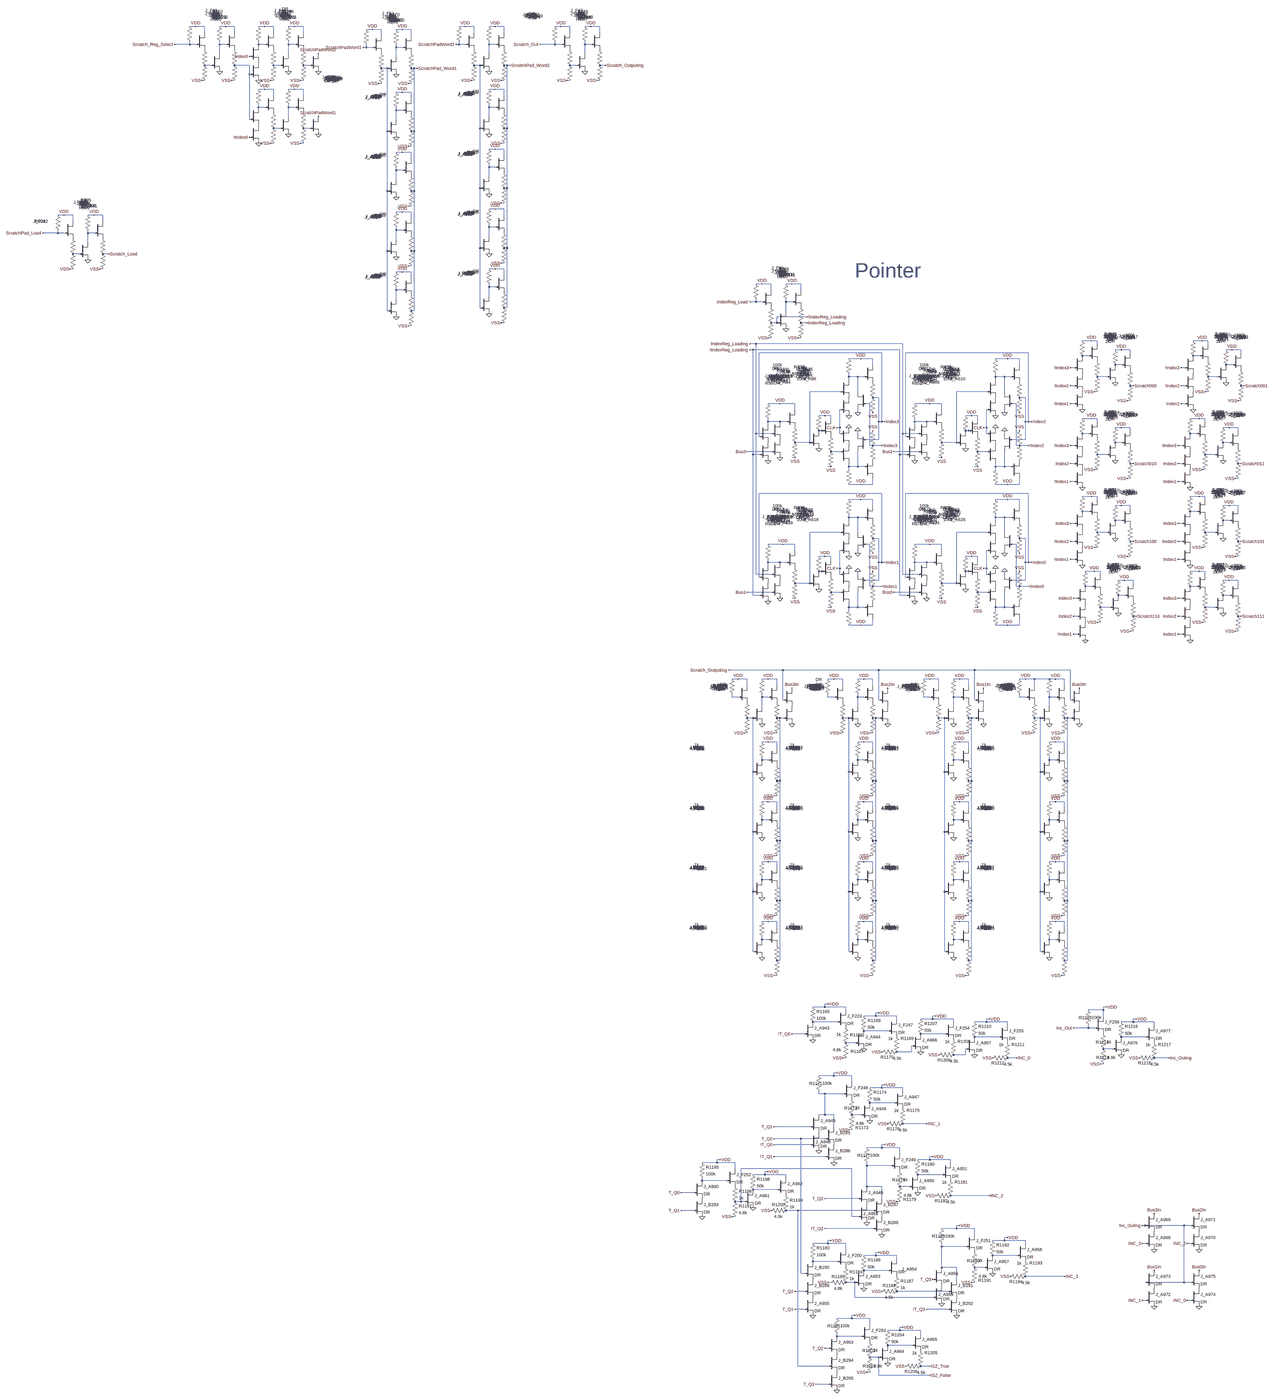
[diagram p0: schematic Controls.asc, whole sheet]
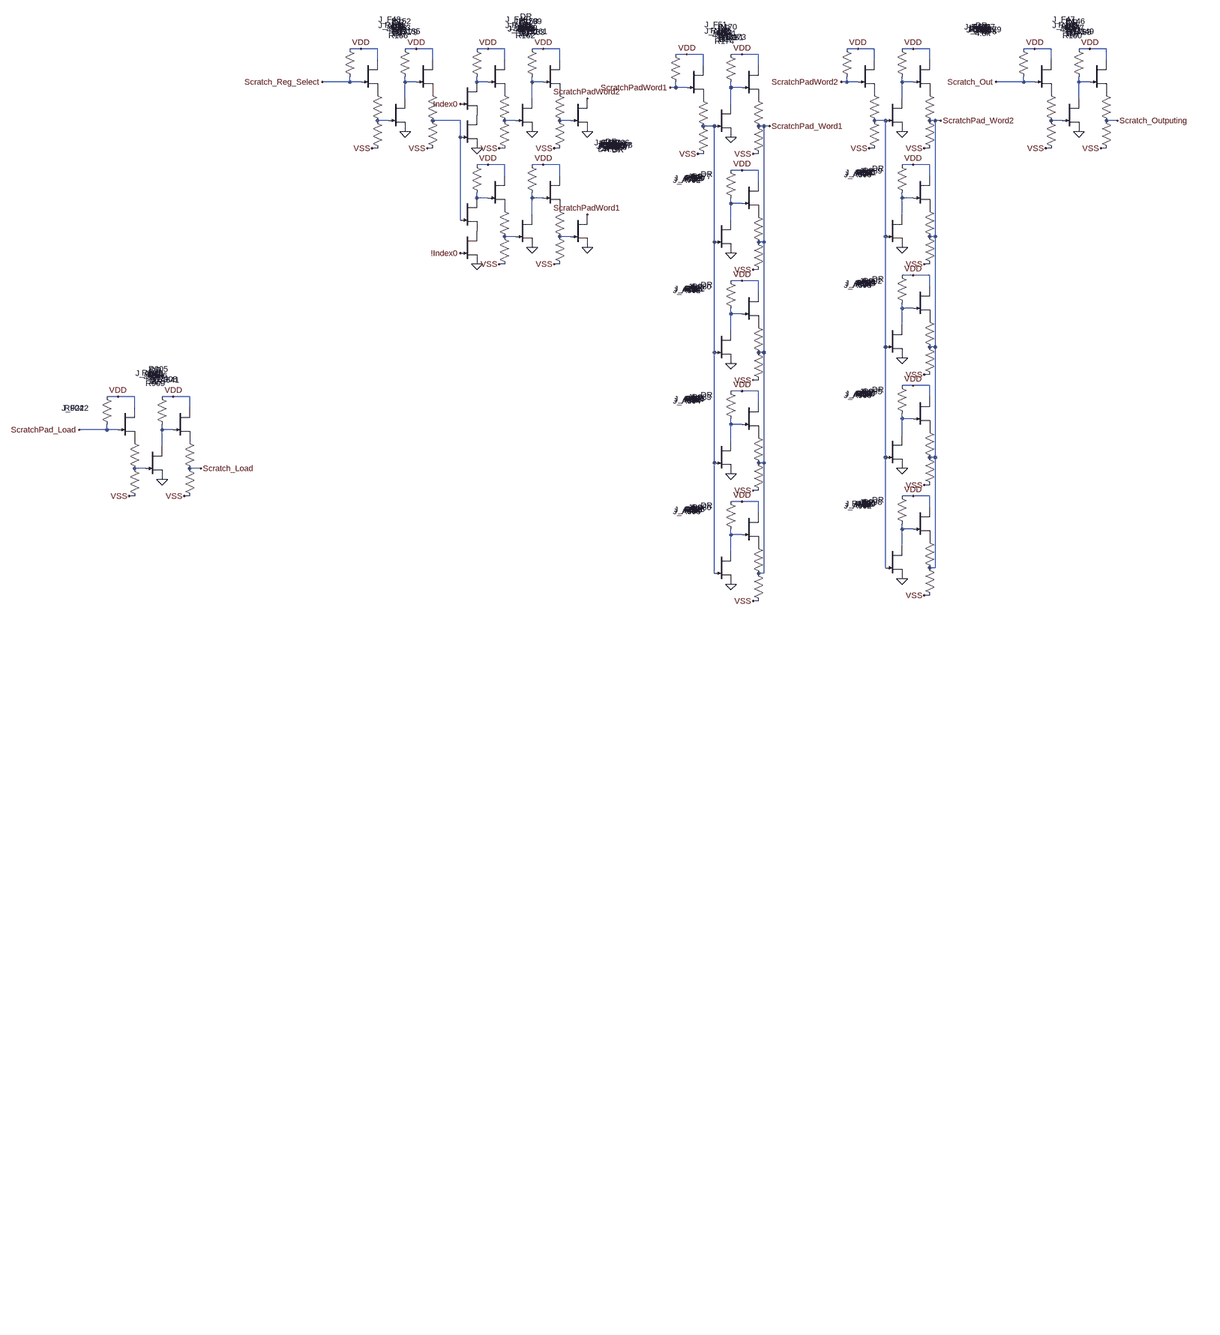
[diagram p1: schematic Controls.asc, part, row 1 of 2, column 1 of 2]
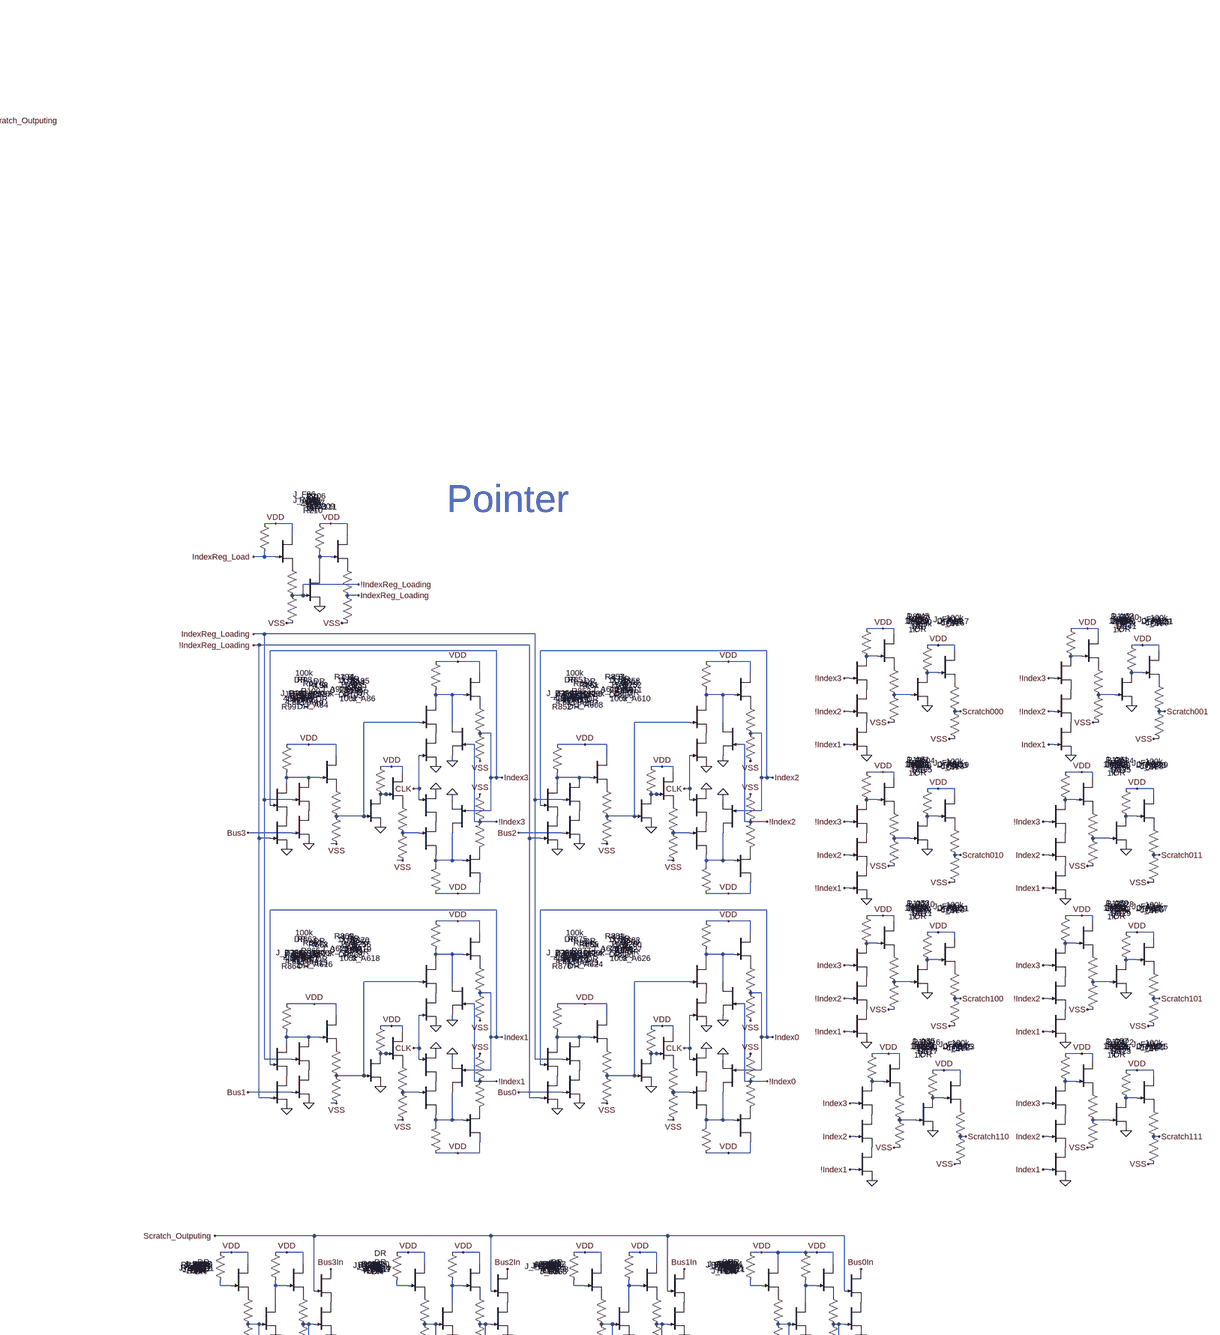
[diagram p2: schematic Controls.asc, part, row 1 of 2, column 2 of 2]
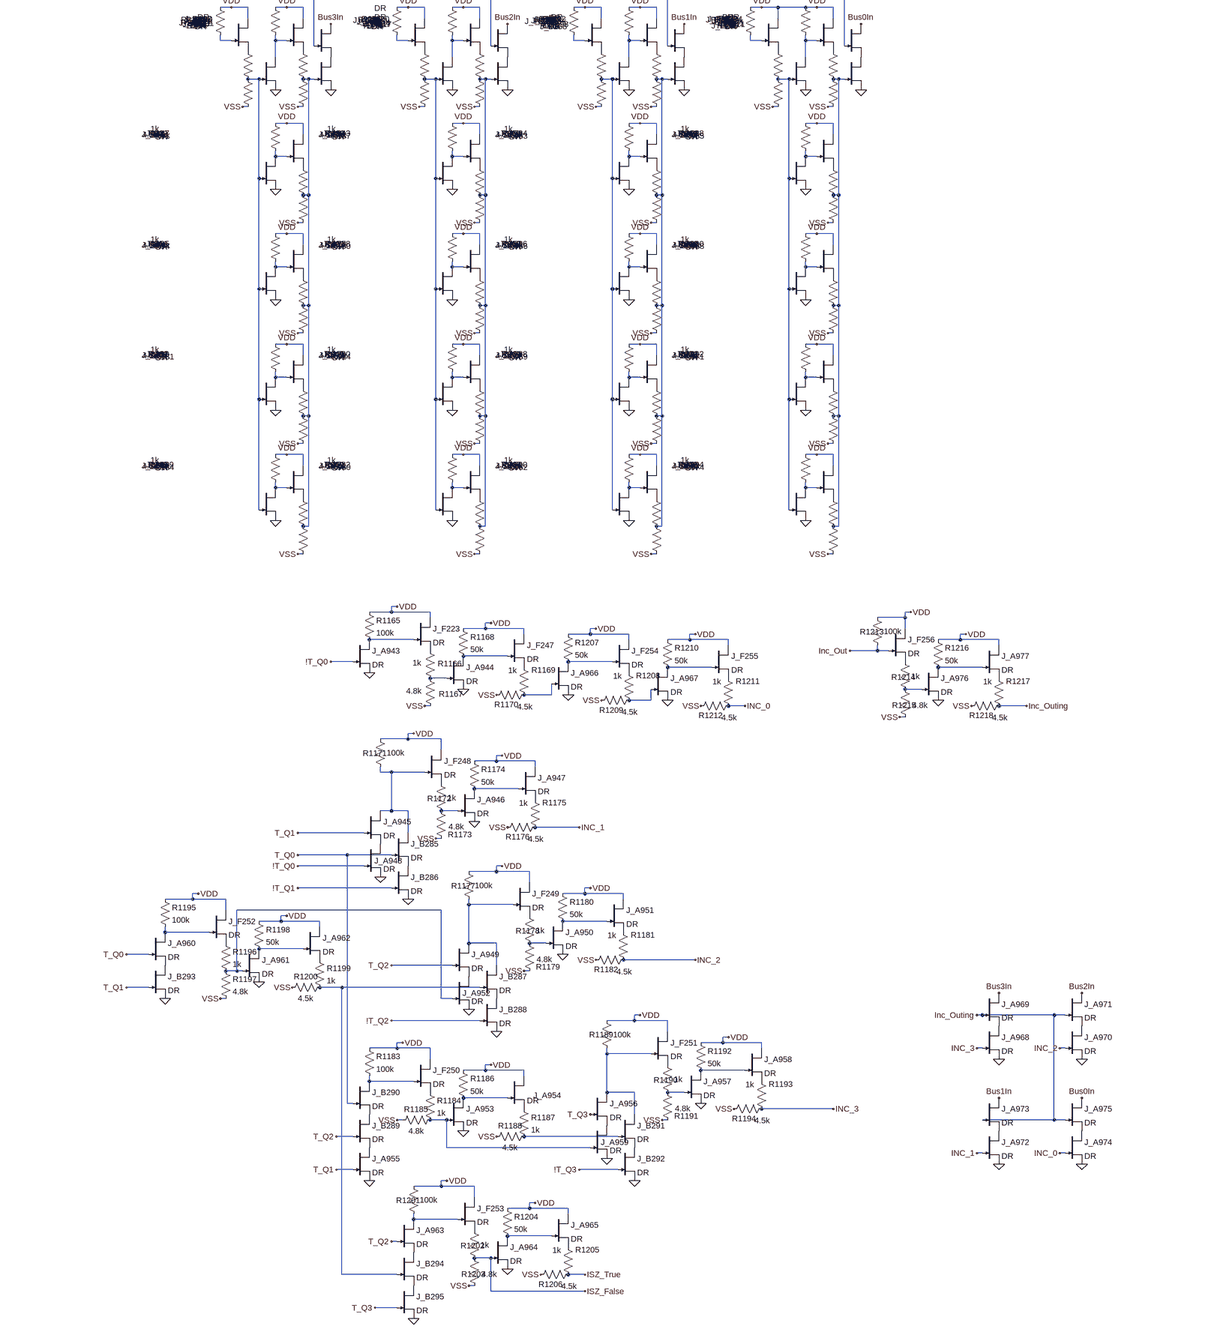
[diagram p3: schematic Controls.asc, part, row 2 of 2, column 2 of 2]
* Controls.asc
J_A48 N033 N037 P001 DR
R97 VDD N033 100k
J_F78 VDD N033 P002 DR
R98 P002 Index3 1k
R99 Index3 VSS 4.8k
J_B32 N033 !Index3 0 DR
J_A49 N051 N047 P003 DR
R100 VDD N051 100k
J_F79 VDD N051 P004 DR
R101 P004 !Index3 1k
R102 !Index3 VSS 4.8k
J_B33 N051 Index3 0 DR
J_A84 P001 CLK 0 DR
J_A85 P003 CLK 0 DR
J_A86 N039 Index3 P005 DR
R193 VDD N039 100k
J_F80 VDD N039 P006 DR
R194 P006 N037 1k
R195 N037 VSS 4.8k
J_B34 N039 IndexReg_Loading P007 DR
J_A87 N041 N037 0 DR
R196 VDD N041 50k
J_A92 VDD N041 P008 DR
R197 P008 N047 1k
R198 N047 VSS 4.5k
J_A93 P005 !IndexReg_Loading 0 DR
J_B35 P007 Bus3 0 DR
J_A606 N034 N038 P009 DR
R850 VDD N034 100k
J_F209 VDD N034 P010 DR
R851 P010 Index2 1k
R852 Index2 VSS 4.8k
J_B249 N034 !Index2 0 DR
J_A607 N052 N048 P011 DR
R853 VDD N052 100k
J_F210 VDD N052 P012 DR
R854 P012 !Index2 1k
R855 !Index2 VSS 4.8k
J_B250 N052 Index2 0 DR
J_A608 P009 CLK 0 DR
J_A609 P011 CLK 0 DR
J_A610 N040 Index2 P013 DR
R856 VDD N040 100k
J_F211 VDD N040 P014 DR
R857 P014 N038 1k
R858 N038 VSS 4.8k
J_B251 N040 IndexReg_Loading P015 DR
J_A611 N042 N038 0 DR
R859 VDD N042 50k
J_A612 VDD N042 P016 DR
R860 P016 N048 1k
R861 N048 VSS 4.5k
J_A613 P013 !IndexReg_Loading 0 DR
J_B252 P015 Bus2 0 DR
J_A614 N055 N059 P017 DR
R862 VDD N055 100k
J_F212 VDD N055 P018 DR
R863 P018 Index1 1k
R864 Index1 VSS 4.8k
J_B253 N055 !Index1 0 DR
J_A615 N073 N069 P019 DR
R865 VDD N073 100k
J_F213 VDD N073 P020 DR
R866 P020 !Index1 1k
R867 !Index1 VSS 4.8k
J_B254 N073 Index1 0 DR
J_A616 P017 CLK 0 DR
J_A617 P019 CLK 0 DR
J_A618 N063 Index1 P021 DR
R868 VDD N063 100k
J_F214 VDD N063 P022 DR
R869 P022 N059 1k
R870 N059 VSS 4.8k
J_B255 N063 IndexReg_Loading P023 DR
J_A619 N065 N059 0 DR
R871 VDD N065 50k
J_A620 VDD N065 P024 DR
R872 P024 N069 1k
R873 N069 VSS 4.5k
J_A621 P021 !IndexReg_Loading 0 DR
J_B256 P023 Bus1 0 DR
J_A622 N056 N060 P025 DR
R874 VDD N056 100k
J_F215 VDD N056 P026 DR
R875 P026 Index0 1k
R876 Index0 VSS 4.8k
J_B257 N056 !Index0 0 DR
J_A623 N074 N070 P027 DR
R877 VDD N074 100k
J_F216 VDD N074 P028 DR
R878 P028 !Index0 1k
R879 !Index0 VSS 4.8k
J_B258 N074 Index0 0 DR
J_A624 P025 CLK 0 DR
J_A625 P027 CLK 0 DR
J_A626 N064 Index0 P029 DR
R880 VDD N064 100k
J_F217 VDD N064 P030 DR
R881 P030 N060 1k
R882 N060 VSS 4.8k
J_B259 N064 IndexReg_Loading P031 DR
J_A627 N066 N060 0 DR
R883 VDD N066 50k
J_A628 VDD N066 P032 DR
R884 P032 N070 1k
R885 N070 VSS 4.5k
J_A629 P029 !IndexReg_Loading 0 DR
J_B260 P031 Bus0 0 DR
R904 VDD ScratchPad_Load 100k
J_F222 VDD ScratchPad_Load P033 DR
R905 P033 N025 1k
R906 N025 VSS 4.8k
J_A640 N024 N025 0 DR
R907 VDD N024 50k
J_A641 VDD N024 P034 DR
R908 P034 Scratch_Load 1k
R909 VSS Scratch_Load 4.5k
J_A44 N029 !Index3 P035 DR
R85 VDD N029 100k
J_F29 VDD N029 P036 DR
R86 P036 N035 1k
R87 N035 VSS 4.8k
J_B16 P035 !Index2 P037 DR
J_A45 N031 N035 0 DR
R88 VDD N031 50k
J_F30 VDD N031 P038 DR
R89 P038 Scratch000 1k
R90 VSS Scratch000 4.5k
J_B17 P037 !Index1 0 DR
J_A50 N043 !Index3 P039 DR
R103 VDD N043 100k
J_F33 VDD N043 P040 DR
R104 P040 N049 1k
R105 N049 VSS 4.8k
J_B18 P039 Index2 P041 DR
J_A51 N045 N049 0 DR
R106 VDD N045 50k
J_F34 VDD N045 P042 DR
R107 P042 Scratch010 1k
R108 VSS Scratch010 4.5k
J_B19 P041 !Index1 0 DR
J_A52 N053 Index3 P043 DR
R109 VDD N053 100k
J_F35 VDD N053 P044 DR
R110 P044 N061 1k
R111 N061 VSS 4.8k
J_B20 P043 !Index2 P045 DR
J_A53 N057 N061 0 DR
R112 VDD N057 50k
J_F36 VDD N057 P046 DR
R113 P046 Scratch100 1k
R114 VSS Scratch100 4.5k
J_B21 P045 !Index1 0 DR
J_A54 N067 Index3 P047 DR
R115 VDD N067 100k
J_F37 VDD N067 P048 DR
R116 P048 N075 1k
R117 N075 VSS 4.8k
J_B22 P047 Index2 P049 DR
J_A55 N071 N075 0 DR
R118 VDD N071 50k
J_F38 VDD N071 P050 DR
R119 P050 Scratch110 1k
R120 VSS Scratch110 4.5k
J_B23 P049 !Index1 0 DR
J_A56 N068 Index3 P051 DR
R121 VDD N068 100k
J_F39 VDD N068 P052 DR
R122 P052 N076 1k
R123 N076 VSS 4.8k
J_B24 P051 Index2 P053 DR
J_A57 N072 N076 0 DR
R124 VDD N072 50k
J_F40 VDD N072 P054 DR
R125 P054 Scratch111 1k
R126 VSS Scratch111 4.5k
J_B25 P053 Index1 0 DR
J_A58 N054 Index3 P055 DR
R127 VDD N054 100k
J_F41 VDD N054 P056 DR
R128 P056 N062 1k
R129 N062 VSS 4.8k
J_B26 P055 !Index2 P057 DR
J_A59 N058 N062 0 DR
R130 VDD N058 50k
J_F42 VDD N058 P058 DR
R131 P058 Scratch101 1k
R132 VSS Scratch101 4.5k
J_B27 P057 Index1 0 DR
J_A60 N044 !Index3 P059 DR
R133 VDD N044 100k
J_F43 VDD N044 P060 DR
R134 P060 N050 1k
R135 N050 VSS 4.8k
J_B28 P059 Index2 P061 DR
J_A61 N046 N050 0 DR
R136 VDD N046 50k
J_F44 VDD N046 P062 DR
R137 P062 Scratch011 1k
R138 VSS Scratch011 4.5k
J_B29 P061 Index1 0 DR
J_A62 N030 !Index3 P063 DR
R139 VDD N030 100k
J_F45 VDD N030 P064 DR
R140 P064 N036 1k
R141 N036 VSS 4.8k
J_B30 P063 !Index2 P065 DR
J_A63 N032 N036 0 DR
R142 VDD N032 50k
J_F46 VDD N032 P066 DR
R143 P066 Scratch001 1k
R144 VSS Scratch001 4.5k
J_B31 P065 Index1 0 DR
R145 VDD Scratch_Out 100k
J_F47 VDD Scratch_Out P067 DR
R146 P067 N012 1k
R147 N012 VSS 4.8k
J_A67 N005 N012 0 DR
R148 VDD N005 50k
J_A68 VDD N005 P068 DR
R149 P068 Scratch_Outputing 1k
R150 VSS Scratch_Outputing 4.5k
R151 VDD Scratch_Reg_Select 100k
J_F48 VDD Scratch_Reg_Select P069 DR
R152 P069 N007 1k
R153 N007 VSS 4.8k
J_A69 N001 N007 0 DR
R154 VDD N001 50k
J_A79 VDD N001 P070 DR
R155 P070 N008 1k
R156 VSS N008 4.5k
R157 VDD N002 100k
J_F49 VDD N002 P071 DR
R158 P071 N009 1k
R159 N009 VSS 4.8k
J_A82 N003 N009 0 DR
R160 VDD N003 50k
J_A83 VDD N003 P072 DR
R161 P072 N010 1k
R162 VSS N010 4.5k
J_A793 N002 Index0 P073 DR
J_A794 P073 N008 0 DR
R163 VDD N014 100k
J_F50 VDD N014 P074 DR
R164 P074 N018 1k
R165 N018 VSS 4.8k
J_A795 N015 N018 0 DR
R166 VDD N015 50k
J_A796 VDD N015 P075 DR
R167 P075 N019 1k
R168 VSS N019 4.5k
J_A797 N014 N008 P076 DR
J_A798 P076 !Index0 0 DR
J_A799 ScratchPadWord2 N010 0 DR
J_A800 ScratchPadWord1 N019 0 DR
R169 VDD ScratchPadWord1 100k
J_F51 VDD ScratchPadWord1 P077 DR
R170 P077 N013 1k
R171 N013 VSS 4.8k
J_A80 N006 N013 0 DR
R172 VDD N006 50k
J_A81 VDD N006 P078 DR
R173 P078 ScratchPad_Word1 1k
R174 VSS ScratchPad_Word1 4.5k
R175 VDD ScratchPadWord2 100k
J_F52 VDD ScratchPadWord2 P079 DR
R176 P079 N011 1k
R177 N011 VSS 4.8k
J_A96 N004 N011 0 DR
R178 VDD N004 50k
J_A97 VDD N004 P080 DR
R179 P080 ScratchPad_Word2 1k
R180 VSS ScratchPad_Word2 4.5k
R205 VDD IndexReg_Load 100k
J_F86 VDD IndexReg_Load P081 DR
R206 P081 !IndexReg_Loading 1k
R207 !IndexReg_Loading VSS 4.8k
J_A102 N028 !IndexReg_Loading 0 DR
R208 VDD N028 50k
J_A111 VDD N028 P082 DR
R209 P082 IndexReg_Loading 1k
R210 VSS IndexReg_Loading 4.5k
R200 VDD N077 100k
J_F58 VDD N077 P083 DR
R201 P083 N085 1k
R203 N085 VSS 4.8k
J_A100 N078 N085 0 DR
R204 VDD N078 50k
J_A101 VDD N078 P084 DR
R211 P084 N086 1k
R212 VSS N086 4.5k
J_F59 P085 N086 0 DR
R213 VDD N079 100k
J_F60 VDD N079 P086 DR
R214 P086 N087 1k
R215 N087 VSS 4.8k
J_A280 N080 N087 0 DR
R216 VDD N080 50k
J_A281 VDD N080 P087 DR
R217 P087 N088 1k
R218 VSS N088 4.5k
J_F61 P088 N088 0 DR
R219 VDD N081 100k
J_F62 VDD N081 P089 DR
R220 P089 N089 1k
R221 N089 VSS 4.8k
J_A282 N082 N089 0 DR
R222 VDD N082 50k
J_A283 VDD N082 P090 DR
R898 P090 N090 1k
R899 VSS N090 4.5k
J_F63 P091 N090 0 DR
R900 VDD N083 100k
J_F71 VDD N083 P092 DR
R901 P092 N091 1k
R902 N091 VSS 4.8k
J_A284 N084 N091 0 DR
R903 VDD N084 50k
J_A285 VDD N084 P093 DR
R911 P093 N092 1k
R912 VSS N092 4.5k
J_F82 P094 N092 0 DR
J_F266 Bus3In Scratch_Outputing P085 DR
J_F267 Bus2In Scratch_Outputing P088 DR
J_F268 Bus1In Scratch_Outputing P091 DR
J_F269 Bus0In Scratch_Outputing P094 DR
J_A46 N093 N085 0 DR
R91 VDD N093 50k
J_A47 VDD N093 P095 DR
R92 P095 N086 1k
R93 VSS N086 4.5k
J_A94 N097 N085 0 DR
R94 VDD N097 50k
J_A95 VDD N097 P096 DR
R95 P096 N086 1k
R96 VSS N086 4.5k
J_A98 N101 N085 0 DR
R181 VDD N101 50k
J_A99 VDD N101 P097 DR
R182 P097 N086 1k
R183 VSS N086 4.5k
J_A638 N105 N085 0 DR
R184 VDD N105 50k
J_A639 VDD N105 P098 DR
R185 P098 N086 1k
R186 VSS N086 4.5k
J_A642 N094 N087 0 DR
R187 VDD N094 50k
J_A643 VDD N094 P099 DR
R188 P099 N088 1k
R189 VSS N088 4.5k
J_A777 N098 N087 0 DR
R190 VDD N098 50k
J_A778 VDD N098 P100 DR
R191 P100 N088 1k
R192 VSS N088 4.5k
J_A779 N102 N087 0 DR
R914 VDD N102 50k
J_A780 VDD N102 P101 DR
R915 P101 N088 1k
R949 VSS N088 4.5k
J_A781 N106 N087 0 DR
R950 VDD N106 50k
J_A782 VDD N106 P102 DR
R951 P102 N088 1k
R952 VSS N088 4.5k
J_A783 N095 N089 0 DR
R953 VDD N095 50k
J_A784 VDD N095 P103 DR
R954 P103 N090 1k
R955 VSS N090 4.5k
J_A785 N099 N089 0 DR
R956 VDD N099 50k
J_A786 VDD N099 P104 DR
R957 P104 N090 1k
R958 VSS N090 4.5k
J_A787 N103 N089 0 DR
R959 VDD N103 50k
J_A788 VDD N103 P105 DR
R960 P105 N090 1k
R961 VSS N090 4.5k
J_A789 N107 N089 0 DR
R962 VDD N107 50k
J_A790 VDD N107 P106 DR
R963 P106 N090 1k
R964 VSS N090 4.5k
J_A887 N096 N091 0 DR
R965 VDD N096 50k
J_A888 VDD N096 P107 DR
R966 P107 N092 1k
R967 VSS N092 4.5k
J_A889 N100 N091 0 DR
R968 VDD N100 50k
J_A890 VDD N100 P108 DR
R969 P108 N092 1k
R970 VSS N092 4.5k
J_A891 N104 N091 0 DR
R971 VDD N104 50k
J_A892 VDD N104 P109 DR
R972 P109 N092 1k
R973 VSS N092 4.5k
J_A893 N108 N091 0 DR
R974 VDD N108 50k
J_A894 VDD N108 P110 DR
R975 P110 N092 1k
R976 VSS N092 4.5k
J_A791 N017 N013 0 DR
R977 VDD N017 50k
J_A792 VDD N017 P111 DR
R978 P111 ScratchPad_Word1 1k
R979 VSS ScratchPad_Word1 4.5k
J_A801 N021 N013 0 DR
R980 VDD N021 50k
J_A802 VDD N021 P112 DR
R981 P112 ScratchPad_Word1 1k
R982 VSS ScratchPad_Word1 4.5k
J_A803 N023 N013 0 DR
R983 VDD N023 50k
J_A804 VDD N023 P113 DR
R984 P113 ScratchPad_Word1 1k
R985 VSS ScratchPad_Word1 4.5k
J_A805 N027 N013 0 DR
R986 VDD N027 50k
J_A806 VDD N027 P114 DR
R987 P114 ScratchPad_Word1 1k
R988 VSS ScratchPad_Word1 4.5k
J_A895 N016 N011 0 DR
R989 VDD N016 50k
J_A896 VDD N016 P115 DR
R990 P115 ScratchPad_Word2 1k
R991 VSS ScratchPad_Word2 4.5k
J_A897 N020 N011 0 DR
R992 VDD N020 50k
J_A898 VDD N020 P116 DR
R993 P116 ScratchPad_Word2 1k
R994 VSS ScratchPad_Word2 4.5k
J_A899 N022 N011 0 DR
R995 VDD N022 50k
J_A900 VDD N022 P117 DR
R996 P117 ScratchPad_Word2 1k
R997 VSS ScratchPad_Word2 4.5k
J_A901 N026 N011 0 DR
R998 VDD N026 50k
J_A902 VDD N026 P118 DR
R999 P118 ScratchPad_Word2 1k
R1000 VSS ScratchPad_Word2 4.5k
J_A943 N109 !T_Q0 0 DR
R1165 VDD N109 100k
J_F223 VDD N109 P119 DR
R1166 P119 N114 1k
R1167 N114 VSS 4.8k
J_A944 N110 N114 0 DR
R1168 VDD N110 50k
J_F247 VDD N110 P120 DR
R1169 P120 N116 1k
R1170 N116 VSS 4.5k
J_A945 N118 T_Q1 P121 DR
R1171 VDD N118 100k
J_F248 VDD N118 P122 DR
R1172 P122 N120 1k
R1173 N120 VSS 4.8k
J_B285 N118 T_Q0 P123 DR
J_A946 N119 N120 0 DR
R1174 VDD N119 50k
J_A947 VDD N119 P124 DR
R1175 P124 INC_1 1k
R1176 INC_1 VSS 4.5k
J_A948 P121 !T_Q0 0 DR
J_B286 P123 !T_Q1 0 DR
J_A949 N121 T_Q2 P125 DR
R1177 VDD N121 100k
J_F249 VDD N121 P126 DR
R1178 P126 N125 1k
R1179 N125 VSS 4.8k
J_B287 N121 N127 P127 DR
J_A950 N123 N125 0 DR
R1180 VDD N123 50k
J_A951 VDD N123 P128 DR
R1181 P128 INC_2 1k
R1182 INC_2 VSS 4.5k
J_A952 P125 N122 0 DR
J_B288 P127 !T_Q2 0 DR
R1183 VDD N130 100k
J_F250 VDD N130 P129 DR
R1184 P129 N133 1k
R1185 N133 VSS 4.8k
J_A953 N132 N133 0 DR
R1186 VDD N132 50k
J_A954 VDD N132 P130 DR
R1187 P130 N134 1k
R1188 N134 VSS 4.5k
J_A955 P131 T_Q1 0 DR
J_B289 P132 T_Q2 P131 DR
J_B290 N130 T_Q0 P132 DR
J_A956 N128 T_Q3 P133 DR
R1189 VDD N128 100k
J_F251 VDD N128 P134 DR
R1190 P134 N131 1k
R1191 N131 VSS 4.8k
J_B291 N128 N134 P135 DR
J_A957 N129 N131 0 DR
R1192 VDD N129 50k
J_A958 VDD N129 P136 DR
R1193 P136 INC_3 1k
R1194 INC_3 VSS 4.5k
J_A959 P133 N133 0 DR
J_B292 P135 !T_Q3 0 DR
J_A960 N124 T_Q0 P137 DR
R1195 VDD N124 100k
J_F252 VDD N124 P138 DR
R1196 P138 N122 1k
R1197 N122 VSS 4.8k
J_A961 N126 N122 0 DR
R1198 VDD N126 50k
J_A962 VDD N126 P139 DR
R1199 P139 N127 1k
R1200 N127 VSS 4.5k
J_B293 P137 T_Q1 0 DR
J_A963 N135 T_Q2 P140 DR
J_B294 P140 N127 P141 DR
R1201 VDD N135 100k
J_F253 VDD N135 P142 DR
R1202 P142 ISZ_False 1k
R1203 ISZ_False VSS 4.8k
J_A964 N136 ISZ_False 0 DR
R1204 VDD N136 50k
J_A965 VDD N136 P143 DR
R1205 P143 ISZ_True 1k
R1206 ISZ_True VSS 4.5k
J_B295 P141 T_Q3 0 DR
J_A966 N111 N116 0 DR
R1207 VDD N111 50k
J_F254 VDD N111 P144 DR
R1208 P144 N117 1k
R1209 N117 VSS 4.5k
J_A967 N112 N117 0 DR
R1210 VDD N112 50k
J_F255 VDD N112 P145 DR
R1211 P145 INC_0 1k
R1212 INC_0 VSS 4.5k
J_A968 P146 INC_3 0 DR
J_A969 Bus3In Inc_Outing P146 DR
J_A970 P147 INC_2 0 DR
J_A971 Bus2In Inc_Outing P147 DR
J_A972 P148 INC_1 0 DR
J_A973 Bus1In Inc_Outing P148 DR
J_A974 P149 INC_0 0 DR
J_A975 Bus0In Inc_Outing P149 DR
R1213 VDD Inc_Out 100k
J_F256 VDD Inc_Out P150 DR
R1214 P150 N115 1k
R1215 N115 VSS 4.8k
J_A976 N113 N115 0 DR
R1216 VDD N113 50k
J_A977 VDD N113 P151 DR
R1217 P151 Inc_Outing 1k
R1218 Inc_Outing VSS 4.5k
.model NJF NJF
.model PJF PJF
.lib standard.jft
* Pointer
.backanno
.end